# EAGLE design Series_I_power (EAGLE 6.5.0)
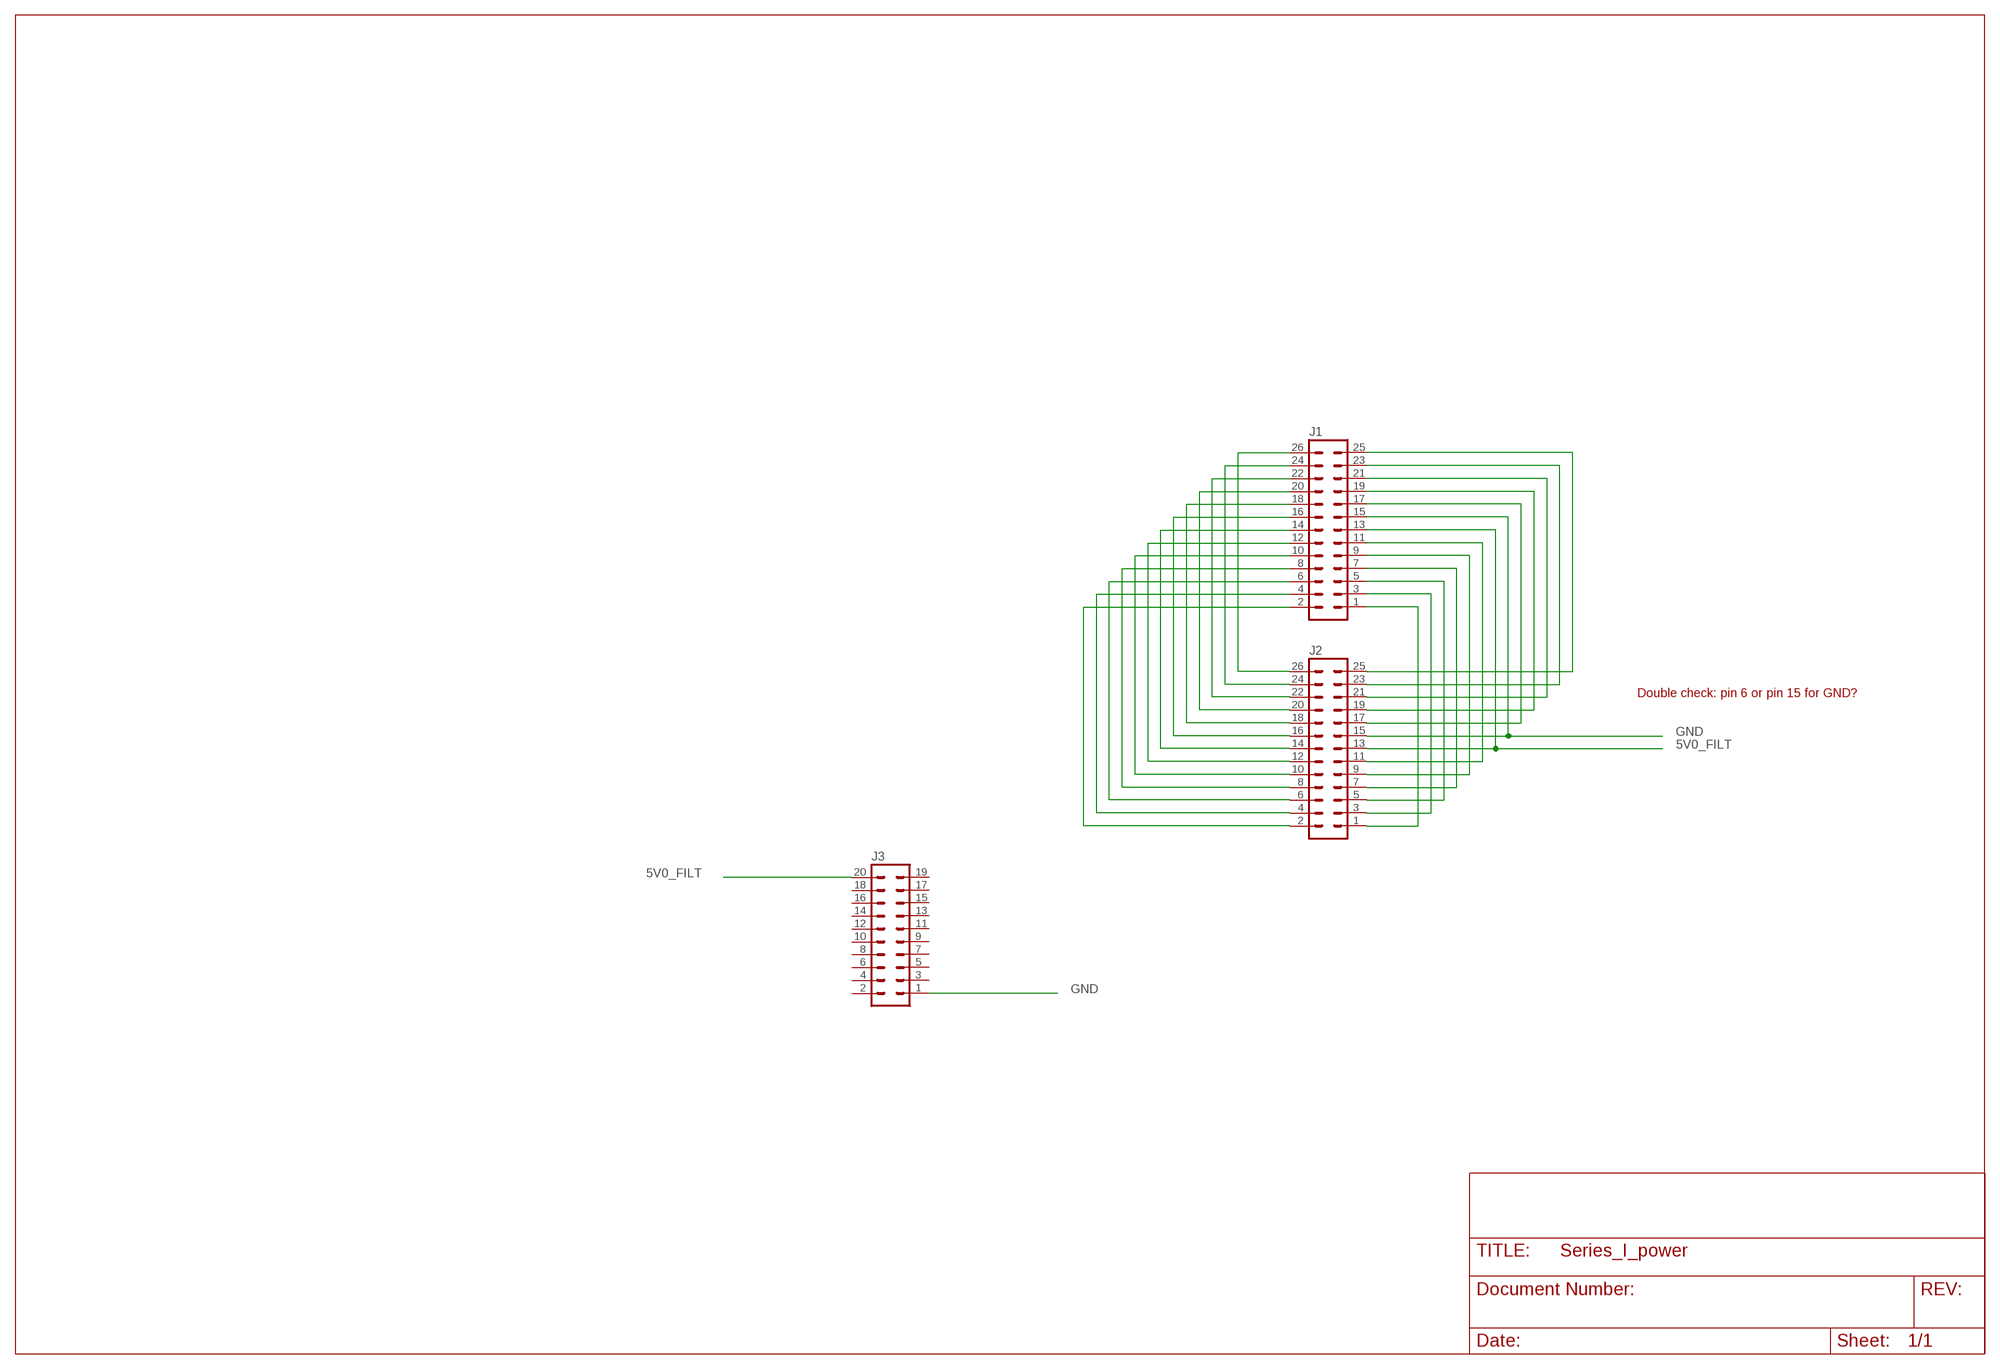
[diagram p0: schematic, sheet 1]

## Parts
J1  26H  [26H]
J2  26H  [26H]
J3  ML20  [ML20]

## Nets
5V0_FILT: J1.13 J2.13 J3.20
GND: J1.15 J2.15 J3.1
N$1: J1.26 J2.26
N$2: J1.24 J2.24
N$3: J1.22 J2.22
N$4: J1.20 J2.20
N$5: J1.18 J2.18
N$6: J1.16 J2.16
N$7: J1.14 J2.14
N$8: J1.12 J2.12
N$9: J1.10 J2.10
N$10: J1.8 J2.8
N$11: J1.6 J2.6
N$12: J1.4 J2.4
N$13: J1.2 J2.2
N$14: J1.1 J2.1
N$15: J1.3 J2.3
N$16: J1.5 J2.5
N$17: J1.7 J2.7
N$18: J1.9 J2.9
N$19: J1.11 J2.11
N$22: J1.17 J2.17
N$23: J1.19 J2.19
N$24: J1.21 J2.21
N$25: J1.23 J2.23
N$26: J1.25 J2.25
Unconnected: J3.2 J3.3 J3.4 J3.5 J3.6 J3.7 J3.8 J3.9 J3.10 J3.11 J3.12 J3.13 J3.14 J3.15 J3.16 J3.17 J3.18 J3.19

## Notes on the sheet
- Double check: pin 6 or pin 15 for GND?

## Library data of the parts
J1 J2 = con-harting-h:26H: CONNECTOR; OC_FARNELL: unknown; OC_NEWARK: unknown
J3 = con-harting-ml:ML20: HARTING; OC_FARNELL: unknown; OC_NEWARK: unknown

## Board
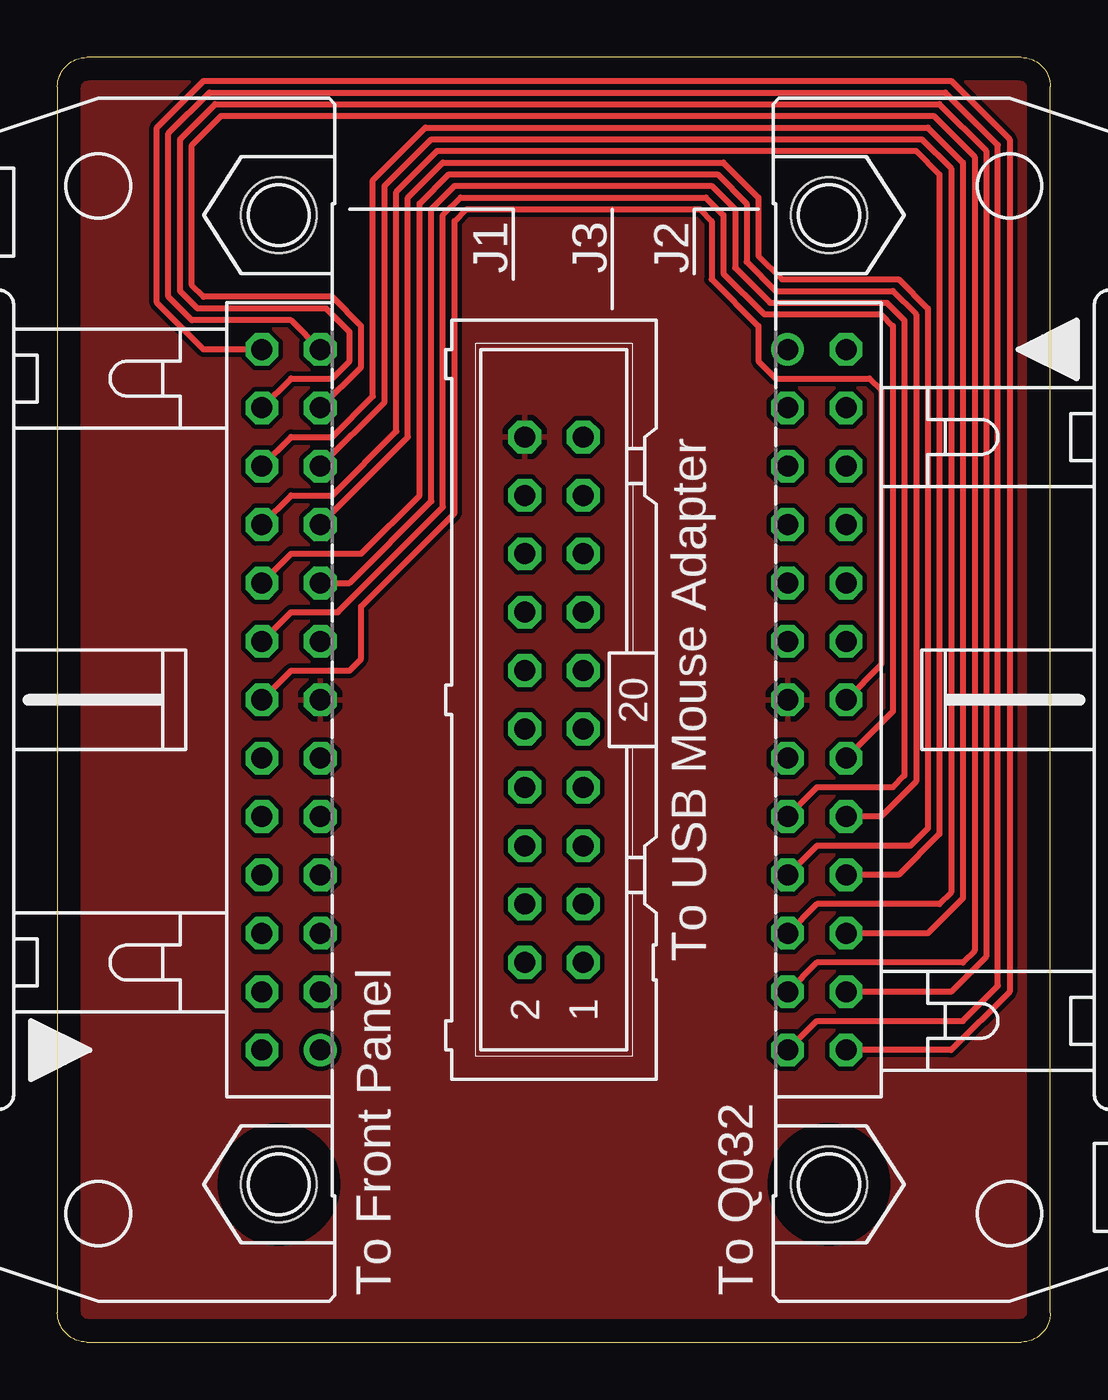
[diagram p1: board, top side]
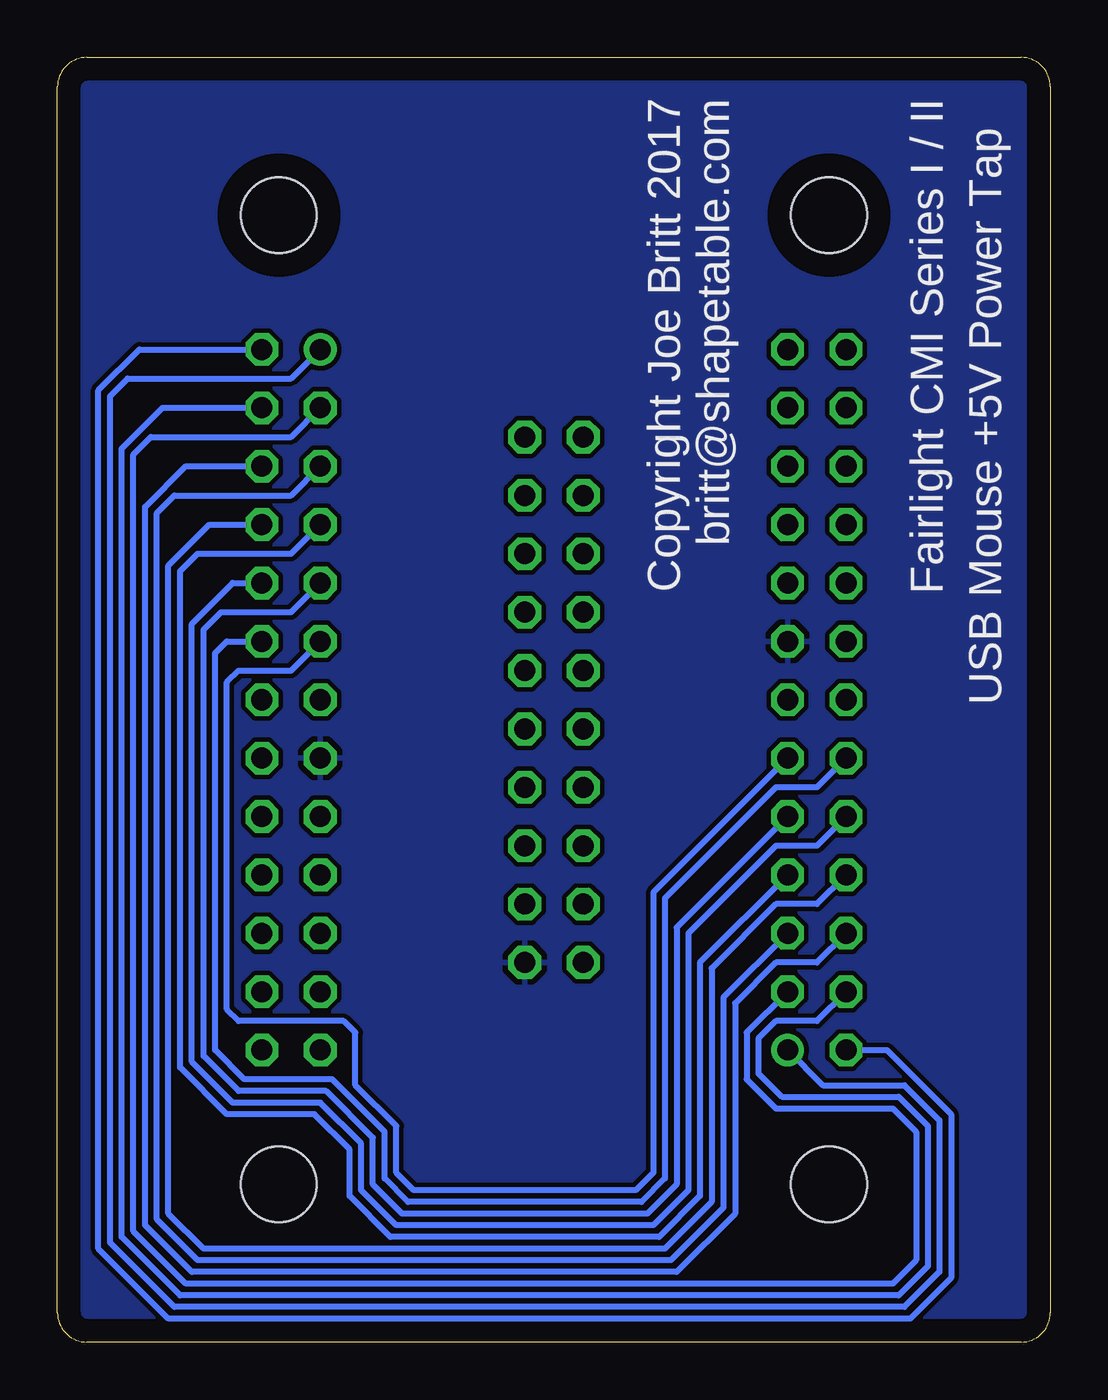
[diagram p2: board, bottom side, seen from below]

Size 43.18 x 55.88 mm. Coordinates in mm from the lower left corner, seen from the top.
Outline: 1.27,0 41.91,0 arc90 43.18,1.27 43.18,54.61 arc90 41.91,55.88 1.27,55.88 arc90 0,54.61 0,1.27 arc90 1.27,0
Copper layers (1*16): Top 0.035mm / dielectric 1.5mm / Bottom 0.035mm
Design rules "default": minimum track width 10mil, minimum drill 24mil, track to track 8mil, track to pad 8mil, pad to pad 8mil, via to via 8mil, smd to smd 8mil, copper to edge 40mil, drill to drill 8mil, minimum pad ring 10mil, minimum via ring 8mil, stop-mask expansion 4mil, vias tented up to drill 0mil, thermal gap 10mil

### Footprints (pad centres in the part's own frame; a part is rotated, then mirrored left to right if it is on the bottom)
26H = drill 0.914: 1 -15.24,-1.27 | drill 0.914 octagon: 2 -15.24,1.27; 3 -12.7,-1.27; 4 -12.7,1.27; 5 -10.16,-1.27; 6 -10.16,1.27; 7 -7.62,-1.27; 8 -7.62,1.27; 9 -5.08,-1.27; 10 -5.08,1.27; 11 -2.54,-1.27; 12 -2.54,1.27; 13 0,-1.27; 14 0,1.27; 15 2.54,-1.27; 16 2.54,1.27; 17 5.08,-1.27; 18 5.08,1.27; 19 7.62,-1.27; 20 7.62,1.27; 21 10.16,-1.27; 22 10.16,1.27; 23 12.7,-1.27; 24 12.7,1.27; 25 15.24,-1.27; 26 15.24,1.27 | hole 3.302: -21.082,0.533; 21.082,0.533
ML20 = drill 0.914 octagon: 1 -11.43,-1.27; 2 -11.43,1.27; 3 -8.89,-1.27; 4 -8.89,1.27; 5 -6.35,-1.27; 6 -6.35,1.27; 7 -3.81,-1.27; 8 -3.81,1.27; 9 -1.27,-1.27; 10 -1.27,1.27; 11 1.27,-1.27; 12 1.27,1.27; 13 3.81,-1.27; 14 3.81,1.27; 15 6.35,-1.27; 16 6.35,1.27; 17 8.89,-1.27; 18 8.89,1.27; 19 11.43,-1.27; 20 11.43,1.27

### Placement (x,y rotation side)
J1  10.16,27.94 90 top
J2  33.02,27.94 270 top
J3  21.59,27.94 90 top

### Tracks (layer width: path | path; a pad name or v marks a point on that pad's centre or on a via)
5V0_FILT
  pour Top (isolate 0.152): 0,0 45.72,0 45.72,55.88 0,55.88
GND
  pour Bottom (isolate 0.152): 0,0 45.72,0 45.72,55.88 0,55.88
N$1
  Top 0.254: J1.26 6.35,43.18 4.32,45.21 4.32,52.83 6.35,54.86 38.86,54.86 41.4,52.32 41.4,15.24 38.86,12.7 J2.26
N$2
  Top 0.254: J1.24 10.16,41.91 11.94,41.91 12.7,42.67 12.7,43.94 11.68,44.96 6.1,44.96 5.33,45.72 5.33,52.32 6.86,53.85 38.35,53.85 40.39,51.82 40.39,16.76 38.86,15.24 J2.24
N$3
  Top 0.254: J1.22 10.16,39.37 11.94,39.37 13.72,41.15 13.72,50.55 16,52.83 37.85,52.83 39.37,51.31 39.37,19.3 37.85,17.78 J2.22
N$4
  Top 0.254: J1.20 10.16,36.83 11.94,36.83 14.73,39.62 14.73,50.04 16.51,51.82 37.34,51.82 38.35,50.8 38.35,22.1 36.58,20.32 J2.20
N$5
  Top 0.254: J1.18 10.16,34.29 13.21,34.29 15.75,36.83 15.75,49.53 17.02,50.8 28.7,50.8 29.97,49.53 29.97,46.99 31.24,45.72 36.32,45.72 37.34,44.7 37.34,24.38 35.81,22.86 J2.18
N$6
  Top 0.254: J1.16 10.16,31.75 12.19,31.75 16.76,36.32 16.76,49.02 17.53,49.78 28.19,49.78 28.96,49.02 28.96,46.48 30.73,44.7 35.81,44.7 36.32,44.2 36.32,27.43 J2.16
N$7
  Top 0.254: J1.14 10.16,29.21 12.7,29.21 13.21,29.72 13.21,32 17.27,36.07 17.27,48.77 17.78,49.28 27.94,49.28 28.45,48.77 28.45,46.23 30.48,44.2 30.48,42.67 31.24,41.91 35.31,41.91 35.81,41.4 35.81,29.46 J2.14
N$8
  Bottom 0.254: J1.12 10.16,24.13 11.94,24.13 16.76,19.3 16.76,7.11 17.78,6.1 27.94,6.1 28.96,7.11 28.96,9.14 31.24,11.43 35.05,11.43 36.32,12.7 36.32,29.97 35.81,30.48 J2.12
N$9
  Bottom 0.254: J1.10 10.16,21.59 11.94,21.59 15.75,17.78 15.75,6.6 17.27,5.08 28.45,5.08 29.97,6.6 29.97,8.64 31.75,10.41 35.56,10.41 37.34,12.19 37.34,31.24 35.56,33.02 J2.10
N$10
  Bottom 0.254: J1.8 10.16,19.05 11.94,19.05 14.73,16.26 14.73,6.1 16.76,4.06 36.83,4.06 38.35,5.59 38.35,33.78 36.58,35.56 J2.8
N$11
  Bottom 0.254: J1.6 10.16,16.51 11.94,16.51 13.72,14.73 13.72,5.59 16.26,3.05 37.34,3.05 39.37,5.08 39.37,36.32 37.59,38.1 J2.6
N$12
  Bottom 0.254: J1.4 10.16,13.97 11.94,13.97 12.7,13.21 12.7,11.68 11.68,10.67 6.6,10.67 5.33,9.4 5.33,3.3 6.6,2.03 37.85,2.03 40.39,4.57 40.39,38.86 38.61,40.64 J2.4
N$13
  Bottom 0.254: J1.2 7.11,12.7 4.32,9.91 4.32,2.79 6.1,1.02 38.35,1.02 41.4,4.06 41.4,41.4 39.62,43.18 J2.2
N$14
  Bottom 0.254: J1.1 9.91,11.18 6.35,11.18 4.83,9.65 4.83,3.05 6.35,1.52 38.1,1.52 40.89,4.32 40.89,41.15 40.13,41.91 33.02,41.91 J2.1
N$15
  Bottom 0.254: J1.3 13.21,13.46 13.21,11.43 11.94,10.16 6.86,10.16 5.84,9.14 5.84,3.56 6.86,2.54 37.59,2.54 39.88,4.83 39.88,38.61 39.12,39.37 33.02,39.37 J2.3
N$16
  Bottom 0.254: J1.5 14.22,14.99 14.22,5.84 16.51,3.56 37.08,3.56 38.86,5.33 38.86,36.07 38.1,36.83 33.02,36.83 J2.5
N$17
  Bottom 0.254: J1.7 15.24,16.51 15.24,6.35 17.02,4.57 28.7,4.57 30.48,6.35 30.48,8.38 32,9.91 35.81,9.91 37.85,11.94 37.85,33.53 37.08,34.29 33.02,34.29 J2.7
N$18
  Bottom 0.254: J1.9 16.26,18.03 16.26,6.86 17.53,5.59 28.19,5.59 29.46,6.86 29.46,8.89 31.5,10.92 35.31,10.92 36.83,12.45 36.83,30.99 36.07,31.75 33.02,31.75 J2.9
N$19
  Bottom 0.254: J1.11 17.27,19.56 17.27,7.37 18.03,6.6 27.69,6.6 28.45,7.37 28.45,9.4 30.23,11.18 30.23,13.46 30.73,13.97 35.31,13.97 35.81,14.48 35.81,28.7 35.31,29.21 33.02,29.21 J2.11
N$22
  Top 0.254: J1.17 12.7,33.02 16.26,36.58 16.26,49.28 17.27,50.29 28.45,50.29 29.46,49.28 29.46,46.74 30.99,45.21 36.07,45.21 36.83,44.45 36.83,24.64 36.32,24.13 33.02,24.13 J2.17
N$23
  Top 0.254: J1.19 15.24,39.37 15.24,49.78 16.76,51.31 28.96,51.31 30.48,49.78 30.48,47.24 31.5,46.23 36.58,46.23 37.85,44.96 37.85,22.35 37.08,21.59 33.02,21.59 J2.19
N$24
  Top 0.254: J1.21 14.22,40.89 14.22,50.29 16.26,52.32 37.59,52.32 38.86,51.05 38.86,19.56 38.35,19.05 33.02,19.05 J2.21
N$25
  Top 0.254: J1.23 13.21,42.42 13.21,44.2 11.94,45.47 6.35,45.47 5.84,45.97 5.84,52.07 7.11,53.34 38.1,53.34 39.88,51.56 39.88,17.02 39.37,16.51 33.02,16.51 J2.23
N$26
  Top 0.254: J1.25 10.16,44.45 5.84,44.45 4.83,45.47 4.83,52.58 6.6,54.36 38.61,54.36 40.89,52.07 40.89,15.49 39.37,13.97 33.02,13.97 J2.25

### Text on the board
tNames: To USB Mouse Adapter | To Front Panel | To Q032
bNames: Fairlight CMI Series I / II | Copyright Joe Britt 2017 / britt@shapetable.com | USB Mouse +5V Power Tap